# Altium project FC.PrjPcb
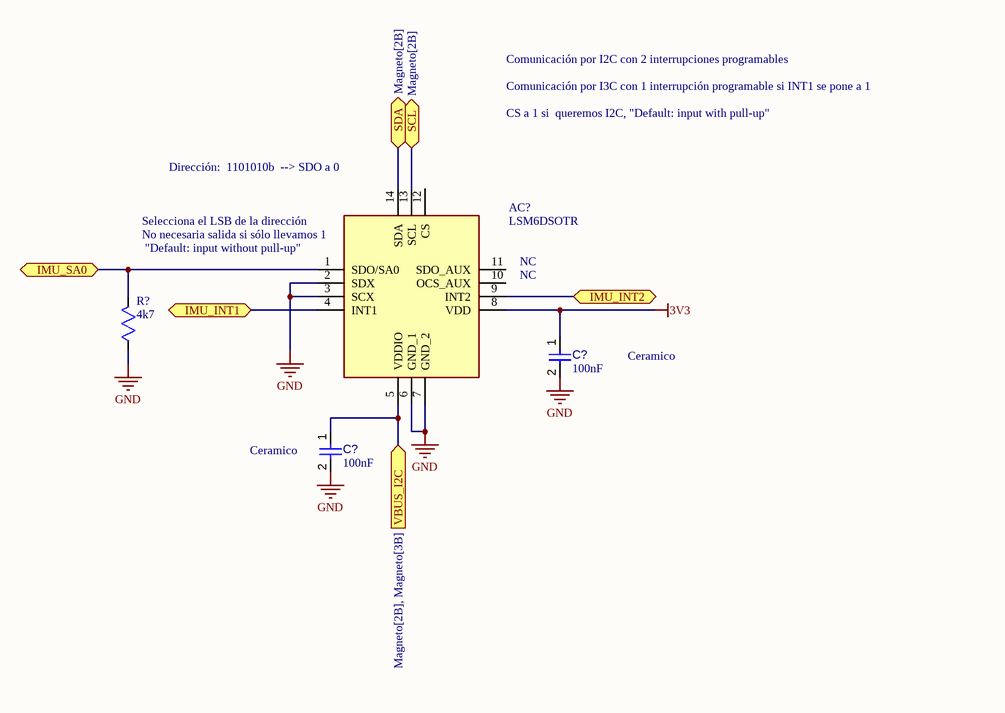
[diagram p0: IMU.SchDoc]
3 sheets, 12 parts. Net scope: flat (ports and power ports of the same name join across sheets).
Sheets:
  IMU.SchDoc
  GPS_NEOM8M.SchDoc
  Magneto.SchDoc

## Sheet IMU.SchDoc
size A4; SheetNumber: 1; SheetTotal: 4

### Parts
(Parts that share a designator on the sheet are numbered #1, #2 ... from top to bottom, then left to right.)
AC?  LSM6DSOTR  [LGA-14(2.5X3X0.86)]
C?#1  value 100nF  [CAPC1005X56X25ML10T15]  (hidden comment: Capacitor 0.1 uF +/- 5% 16 V 0402)
C?#2  value 100nF  [CAPC1005X56X25ML10T15]  (hidden comment: Capacitor 0.1 uF +/- 5% 16 V 0402)
R?  Valor: 4k7  [RES SMD 0805]  (hidden comment: RES_0805_4k7)

### Ports
IMU_INT1 (bidir), IMU_INT2 (bidir), IMU_SA0 (bidir), SCL (bidir, see Magneto[2B]), SDA (bidir, see Magneto[2B]), VBUS_I2C (in, see Magneto[2B], Magneto[3B])

### Nets
3V3: AC?.8(VDD) C?#1.1
GND: AC?.2(SDX) AC?.3(SCX) AC?.6(GND_1) AC?.7(GND_2) C?#1.2 C?#2.2 R?.1
NetAC?_1: AC?.1(SDO/SA0) R?.2 ; port IMU_SA0
NetAC?_4: AC?.4(INT1) ; port IMU_INT1
NetAC?_5: AC?.5(VDDIO) C?#2.1 ; port VBUS_I2C
NetAC?_9: AC?.9(INT2) ; port IMU_INT2
NetAC?_13: AC?.13(SCL) ; port SCL
NetAC?_14: AC?.14(SDA) ; port SDA

Not connected (* = marked no-connect by the designer): AC? 10(OCS_AUX) 11(SDO_AUX) 12(CS)

### Notes on the sheet
- Comunicación por I2C con 2 interrupciones programables
- Comunicación por I3C con 1 interrupción programable si INT1 se pone a 1
- CS a 1 si  queremos I2C, "Default: input with pull-up"
- (near AC?) Dirección:  1101010b  --> SDO a 0
- (near AC?) No necesaria salida si sólo llevamos 1
- (near AC?) Selecciona el LSB de la dirección
- (near AC?) "Default: input without pull-up"
- (near AC?) NC
- Ceramico
- (near C?#2) Ceramico

### Library data of the parts
AC? = LSM6DSOTR: Accelerometer; Manufacturer_Name: STMicroelectronics; Datasheet Link: https://www.st.com/resource/en/datasheet/lsm6dso.pdf; Manufacturer_Part_Number: LSM6DSOTR; Mouser Part Number: 511-LSM6DSOTR; Mouser Price/Stock: https://www.mouser.co.uk/ProductDetail/STMicroelectronics/LSM6DSOTR?qs=lc2O%252BfHJPVbD197C5c7oNw%3D%3D; Arrow Part Number: LSM6DSOTR; Arrow Price/Stock: https://www.arrow.com/en/products/lsm6dsotr/stmicroelectronics?region=nac
C?#1 C?#2 = CMP-001-00001-4: Chip Capacitor, 0.1 uF, +/- 5%, 16 V, 0402 (1005 Metric); Voltage Rating: 16V; Capacitor Type: Ceramic; Pins: 2; Min Operating Temperature: -55°C; Mounting Technology: SM; Max Operating Temperature: 125°C; RoHS Compliant: True; Case/Package: 0402; Tolerance: 5%
R? = CMP-088-000005-1: Resistencia 0805 4k7; RefDistribuidor: -; ComponentLink1Description: Link-Compra; Design Item ID: RES_0805_4k7; Fabricante: -; ComponentLink1URL: -; Source: ARUS2021.SchLib; ComponentLink2URL: -; RefFabricante: -; ComponentLink2Description: Datasheet; Distribuidor: -

## Sheet GPS_NEOM8M.SchDoc
size A4; SheetNumber: 2; SheetTotal: 3
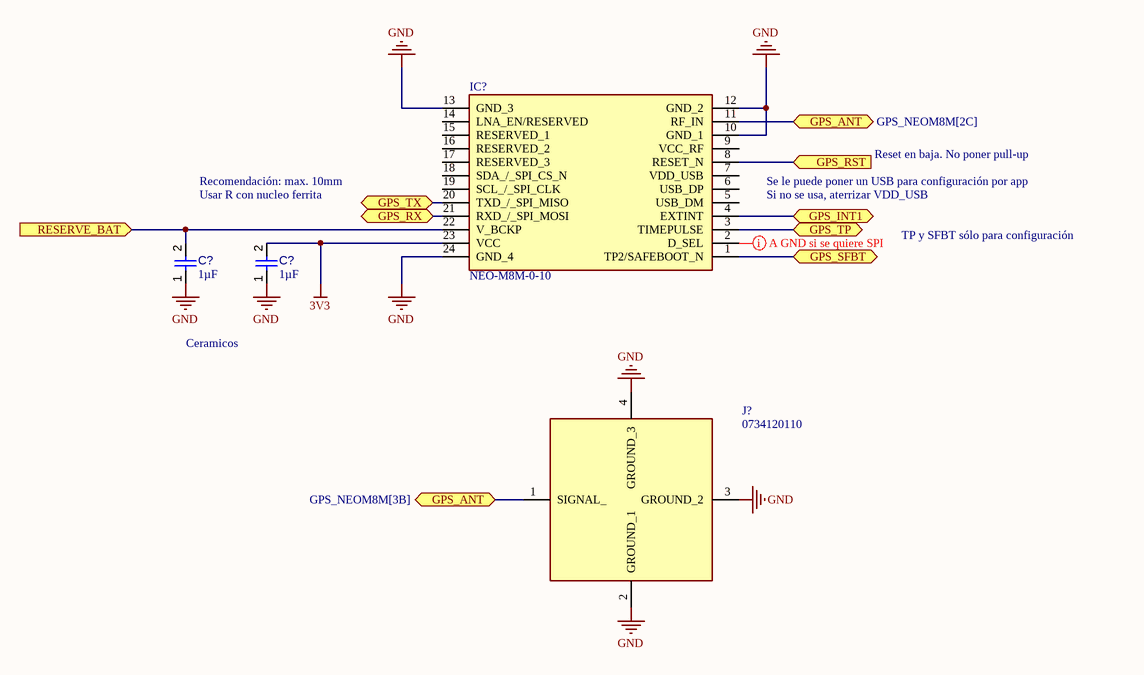
[diagram p1: GPS_NEOM8M.SchDoc]

### Parts
(Parts that share a designator on the sheet are numbered #1, #2 ... from top to bottom, then left to right.)
C?#3  value 1µF  [CAPC3216X180X20ML20]  (hidden comment: Capacitor 1 uF +/- 10% 25 V 1206)
C?#4  value 1µF  [CAPC3216X180X20ML20]  (hidden comment: Capacitor 1 uF +/- 10% 25 V 1206)
IC?#1  NEO-M8M-0-10  [NEO-M8T]
J?  0734120110  [0734120110]

### Ports
GPS_ANT (bidir, see GPS_NEOM8M[2C]), GPS_ANT (bidir, see GPS_NEOM8M[3B]), GPS_INT1 (bidir), GPS_RST (in), GPS_RX (bidir), GPS_SFBT (bidir), GPS_TP (bidir), GPS_TX (bidir), RESERVE_BAT (in)

### Nets
3V3: C?#4.2 IC?#1.23(VCC)
GND: C?#3.1 C?#4.1 IC?#1.10(GND_1) IC?#1.12(GND_2) IC?#1.13(GND_3) IC?#1.24(GND_4) J?.2(GROUND_1) J?.3(GROUND_2) J?.4(GROUND_3)
NetC?#3_2: C?#3.2 IC?#1.22(V_BCKP) ; port RESERVE_BAT
NetIC?#1_1: IC?#1.1(TP2/SAFEBOOT_N) ; port GPS_SFBT
NetIC?#1_3: IC?#1.3(TIMEPULSE) ; port GPS_TP
NetIC?#1_4: IC?#1.4(EXTINT) ; port GPS_INT1
NetIC?#1_8: IC?#1.8(RESET_N) ; port GPS_RST
NetIC?#1_11: IC?#1.11(RF_IN) J?.1(SIGNAL_) ; port GPS_ANT
NetIC?#1_20: IC?#1.20(TXD_/_SPI_MISO) ; port GPS_TX
NetIC?#1_21: IC?#1.21(RXD_/_SPI_MOSI) ; port GPS_RX

Not connected (* = marked no-connect by the designer): IC?#1 2(D_SEL) 5(USB_DM) 6(USB_DP) 7(VDD_USB) 9(VCC_RF) 14(LNA_EN/RESERVED) 15(RESERVED_1) 16(RESERVED_2) 17(RESERVED_3) 18(SDA_/_SPI_CS_N) 19(SCL_/_SPI_CLK)

### Layout directives
mark named A GND si se quiere SPI: NetIC?#1_2

### Notes on the sheet
- Recomendación: max. 10mm
- Se le puede poner un USB para configuración por app
- Reset en baja. No poner pull-up
- Usar R con nucleo ferrita
- Si no se usa, aterrizar VDD_USB
- TP y SFBT sólo para configuración
- Ceramicos

### Library data of the parts
C?#3 C?#4 = CMP-001-00006-4: Chip Capacitor, 1 uF, +/- 10%, 25 V, 1206 (3216 Metric); Voltage Rating: 25V; Capacitor Type: Ceramic; RoHS Compliant: True; Pins: 2; Min Operating Temperature: -55°C; Mounting Technology: SM; Max Operating Temperature: 125°C; Tolerance: 10%; Case/Package: 1206
IC?#1 = NEO-M8M-0-10: Integrated Circuit; Manufacturer_Name: U-Blox; Datasheet Link: https://www.u-blox.com/sites/default/files/NEO-M8-FW3_DataSheet_%28UBX-15031086%29.pdf; Manufacturer_Part_Number: NEO-M8M-0-10
J? = 0734120110: Connector; Manufacturer_Name: Molex; Datasheet Link: https://www.molex.com/pdm_docs/sd/734120110_sd.pdf; Height: 1.36mm; Manufacturer_Part_Number: 0734120110; Mouser Part Number: N/A; Mouser Price/Stock: https://www.mouser.co.uk/ProductDetail/Molex/0734120110?qs=PBcRNPEHKsq%2FACQpFpzyEA%3D%3D; Arrow Part Number: 0734120110; Arrow Price/Stock: https://www.arrow.com/en/products/0734120110/molex?region=europe

## Sheet Magneto.SchDoc
size A4; SheetNumber: 3; SheetTotal: 3
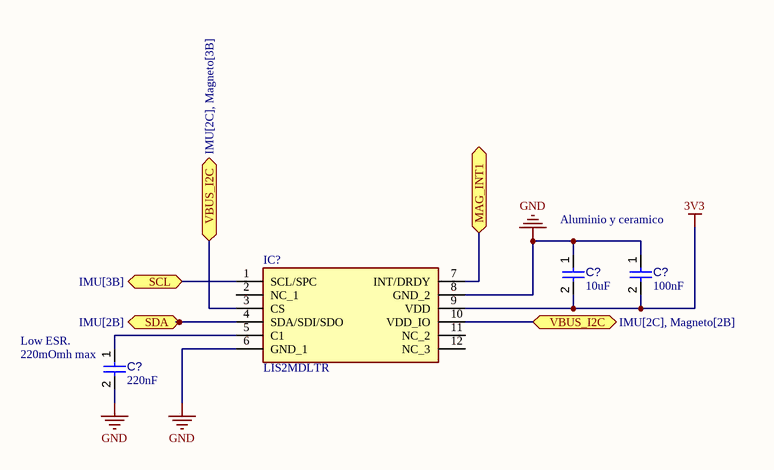
[diagram p2: Magneto.SchDoc]

### Parts
(Parts that share a designator on the sheet are numbered #1, #2 ... from top to bottom, then left to right.)
C?#5  value 10uF  [CAPC1005X56X25ML10T15]  (hidden comment: Capacitor 0.1 uF +/- 5% 16 V 0402)
C?#6  value 100nF  [CAPC1005X56X25ML10T15]  (hidden comment: Capacitor 0.1 uF +/- 5% 16 V 0402)
C?#7  value 220nF  [CAPC1005X56X25ML10T15]  (hidden comment: Capacitor 0.1 uF +/- 5% 16 V 0402)
IC?#2  LIS2MDLTR  [LGA-12]

### Ports
MAG_INT1 (bidir), SCL (bidir, see IMU[3B]), SDA (bidir, see IMU[2B]), VBUS_I2C (bidir, see IMU[2C], Magneto[2B]), VBUS_I2C (bidir, see IMU[2C], Magneto[3B])

### Nets
3V3: C?#5.2 C?#6.2 IC?#2.9(VDD)
GND: C?#5.1 C?#6.1 C?#7.2 IC?#2.6(GND_1) IC?#2.8(GND_2)
NetAC?_5: IC?#2.3(CS) IC?#2.10(VDD_IO) ; port VBUS_I2C
NetAC?_13: IC?#2.1(SCL/SPC) ; port SCL
NetAC?_14: IC?#2.4(SDA/SDI/SDO) ; port SDA
NetC?#7_1: C?#7.1 IC?#2.5(C1)
NetIC?#2_7: IC?#2.7(INT/DRDY) ; port MAG_INT1

Not connected (* = marked no-connect by the designer): IC?#2 2(NC_1) 11(NC_2) 12(NC_3)

### Notes on the sheet
- (near C?#5) Aluminio y ceramico
- (near C?#7) Low ESR.
- (near C?#7) 220mOmh max

### Library data of the parts
C?#5-C?#7 = CMP-001-00001-4: as C?#1 on sheet IMU; Pins: 2; Min Operating Temperature: -55°C; Mounting Technology: SM; Max Operating Temperature: 125°C; RoHS Compliant: True; Case/Package: 0402; Tolerance: 5%
IC?#2 = LIS2MDLTR: Integrated Circuit; Manufacturer_Name: STMicroelectronics; Datasheet Link: http://www.st.com/content/ccc/resource/technical/document/datasheet/group3/29/13/d1/e0/9a/4d/4f/30/DM00395193/files/DM00395193.pdf/jcr:content/translations/en.DM00395193.pdf; Manufacturer_Part_Number: LIS2MDLTR; Mouser Part Number: 511-LIS2MDLTR; Mouser Price/Stock: https://www.mouser.co.uk/ProductDetail/STMicroelectronics/LIS2MDLTR?qs=5aG0NVq1C4wS0n6b5NiBNQ%3D%3D; Arrow Part Number: LIS2MDLTR; Arrow Price/Stock: https://www.arrow.com/en/products/lis2mdltr/stmicroelectronics?region=nac

## Nets that join several sheets
3V3: IMU (AC?.8 C?#1.1), GPS_NEOM8M (C?#4.2 IC?#1.23), Magneto (C?#5.2 C?#6.2 IC?#2.9)
GND: IMU (7 pins), GPS_NEOM8M (9 pins), Magneto (5 pins)
NetAC?_5: IMU (AC?.5 C?#2.1), Magneto (IC?#2.3 IC?#2.10)
NetAC?_13: IMU (AC?.13), Magneto (IC?#2.1)
NetAC?_14: IMU (AC?.14), Magneto (IC?#2.4)